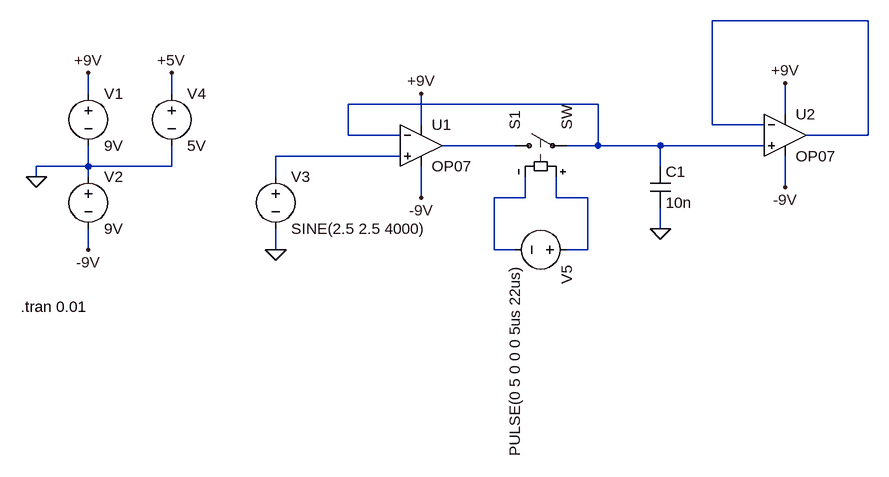
[diagram p0: schematic r2_switch.asc]
r2_switch.asc, the LTspice schematic file:
Version 4
SHEET 1 1004 680
WIRE 912 -128 672 -128
WIRE -288 -16 -288 -48
WIRE -160 -16 -160 -48
WIRE 496 0 112 0
WIRE 784 16 784 -32
WIRE 224 32 224 -16
WIRE 672 32 672 -128
WIRE 752 32 672 32
WIRE 112 48 112 0
WIRE 192 48 112 48
WIRE 912 48 912 -128
WIRE 912 48 816 48
WIRE 368 64 256 64
WIRE 496 64 496 0
WIRE 496 64 448 64
WIRE 592 64 496 64
WIRE 752 64 592 64
WIRE 192 80 0 80
WIRE -288 96 -288 64
WIRE -288 96 -368 96
WIRE -160 96 -160 64
WIRE -160 96 -288 96
WIRE 592 96 592 64
WIRE -368 112 -368 96
WIRE -288 112 -288 96
WIRE 0 112 0 80
WIRE 784 128 784 80
WIRE 224 144 224 96
WIRE 384 144 384 112
WIRE 384 144 336 144
WIRE 432 144 432 112
WIRE 480 144 432 144
WIRE 592 192 592 160
WIRE -288 224 -288 192
WIRE 0 224 0 192
WIRE 336 224 336 144
WIRE 368 224 336 224
WIRE 480 224 480 144
WIRE 480 224 448 224
FLAG -368 112 0
FLAG -288 -48 +9V
FLAG -288 224 -9V
FLAG 0 224 0
FLAG -160 -48 +5V
FLAG 224 -16 +9V
FLAG 224 144 -9V
FLAG 592 192 0
FLAG 784 -32 +9V
FLAG 784 128 -9V
SYMBOL voltage -288 -32 R0
WINDOW 123 0 0 Left 0
WINDOW 39 0 0 Left 0
SYMATTR InstName V1
SYMATTR Value 9V
SYMBOL voltage -288 96 R0
WINDOW 123 0 0 Left 0
WINDOW 39 0 0 Left 0
SYMATTR InstName V2
SYMATTR Value 9V
SYMBOL voltage -160 -32 R0
WINDOW 123 0 0 Left 0
WINDOW 39 0 0 Left 0
SYMATTR InstName V4
SYMATTR Value 5V
SYMBOL Opamps\\OP07 224 0 R0
SYMATTR InstName U1
SYMBOL voltage 0 96 R0
WINDOW 123 0 0 Left 0
WINDOW 39 0 0 Left 0
SYMATTR InstName V3
SYMATTR Value SINE(2.5 2.5 4000)
SYMBOL sw 352 64 R270
SYMATTR InstName S1
SYMBOL cap 576 96 R0
SYMATTR InstName C1
SYMATTR Value 10n
SYMBOL Opamps\\OP07 784 -16 R0
SYMATTR InstName U2
SYMBOL voltage 464 224 R90
WINDOW 123 0 0 Left 0
WINDOW 39 0 0 Left 0
SYMATTR InstName V5
SYMATTR Value PULSE(0 5 0 0 0 5us 22us)
TEXT -392 312 Left 2 !.tran 0.01

The netlist it stands for:
* r2_switch.asc
V1 +9V 0 9V
V2 0 -9V 9V
V4 +5V 0 5V
XU1 N004 N002 +9V -9V N003 LT1001  ; OP07, pins In+ In- V+ V- OUT
V3 N004 0 SINE(2.5 2.5 4000)
S1 N003 N002 N006 N005 SW
C1 N002 0 10n
XU2 N002 N001 +9V -9V N001 LT1001  ; OP07, pins In+ In- V+ V- OUT
V5 N006 N005 PULSE(0 5 0 0 0 5us 22us)
.tran 0.01
.lib LTC.lib
.backanno
.end